# EAGLE design bristol_longshot (EAGLE 7.3.0)
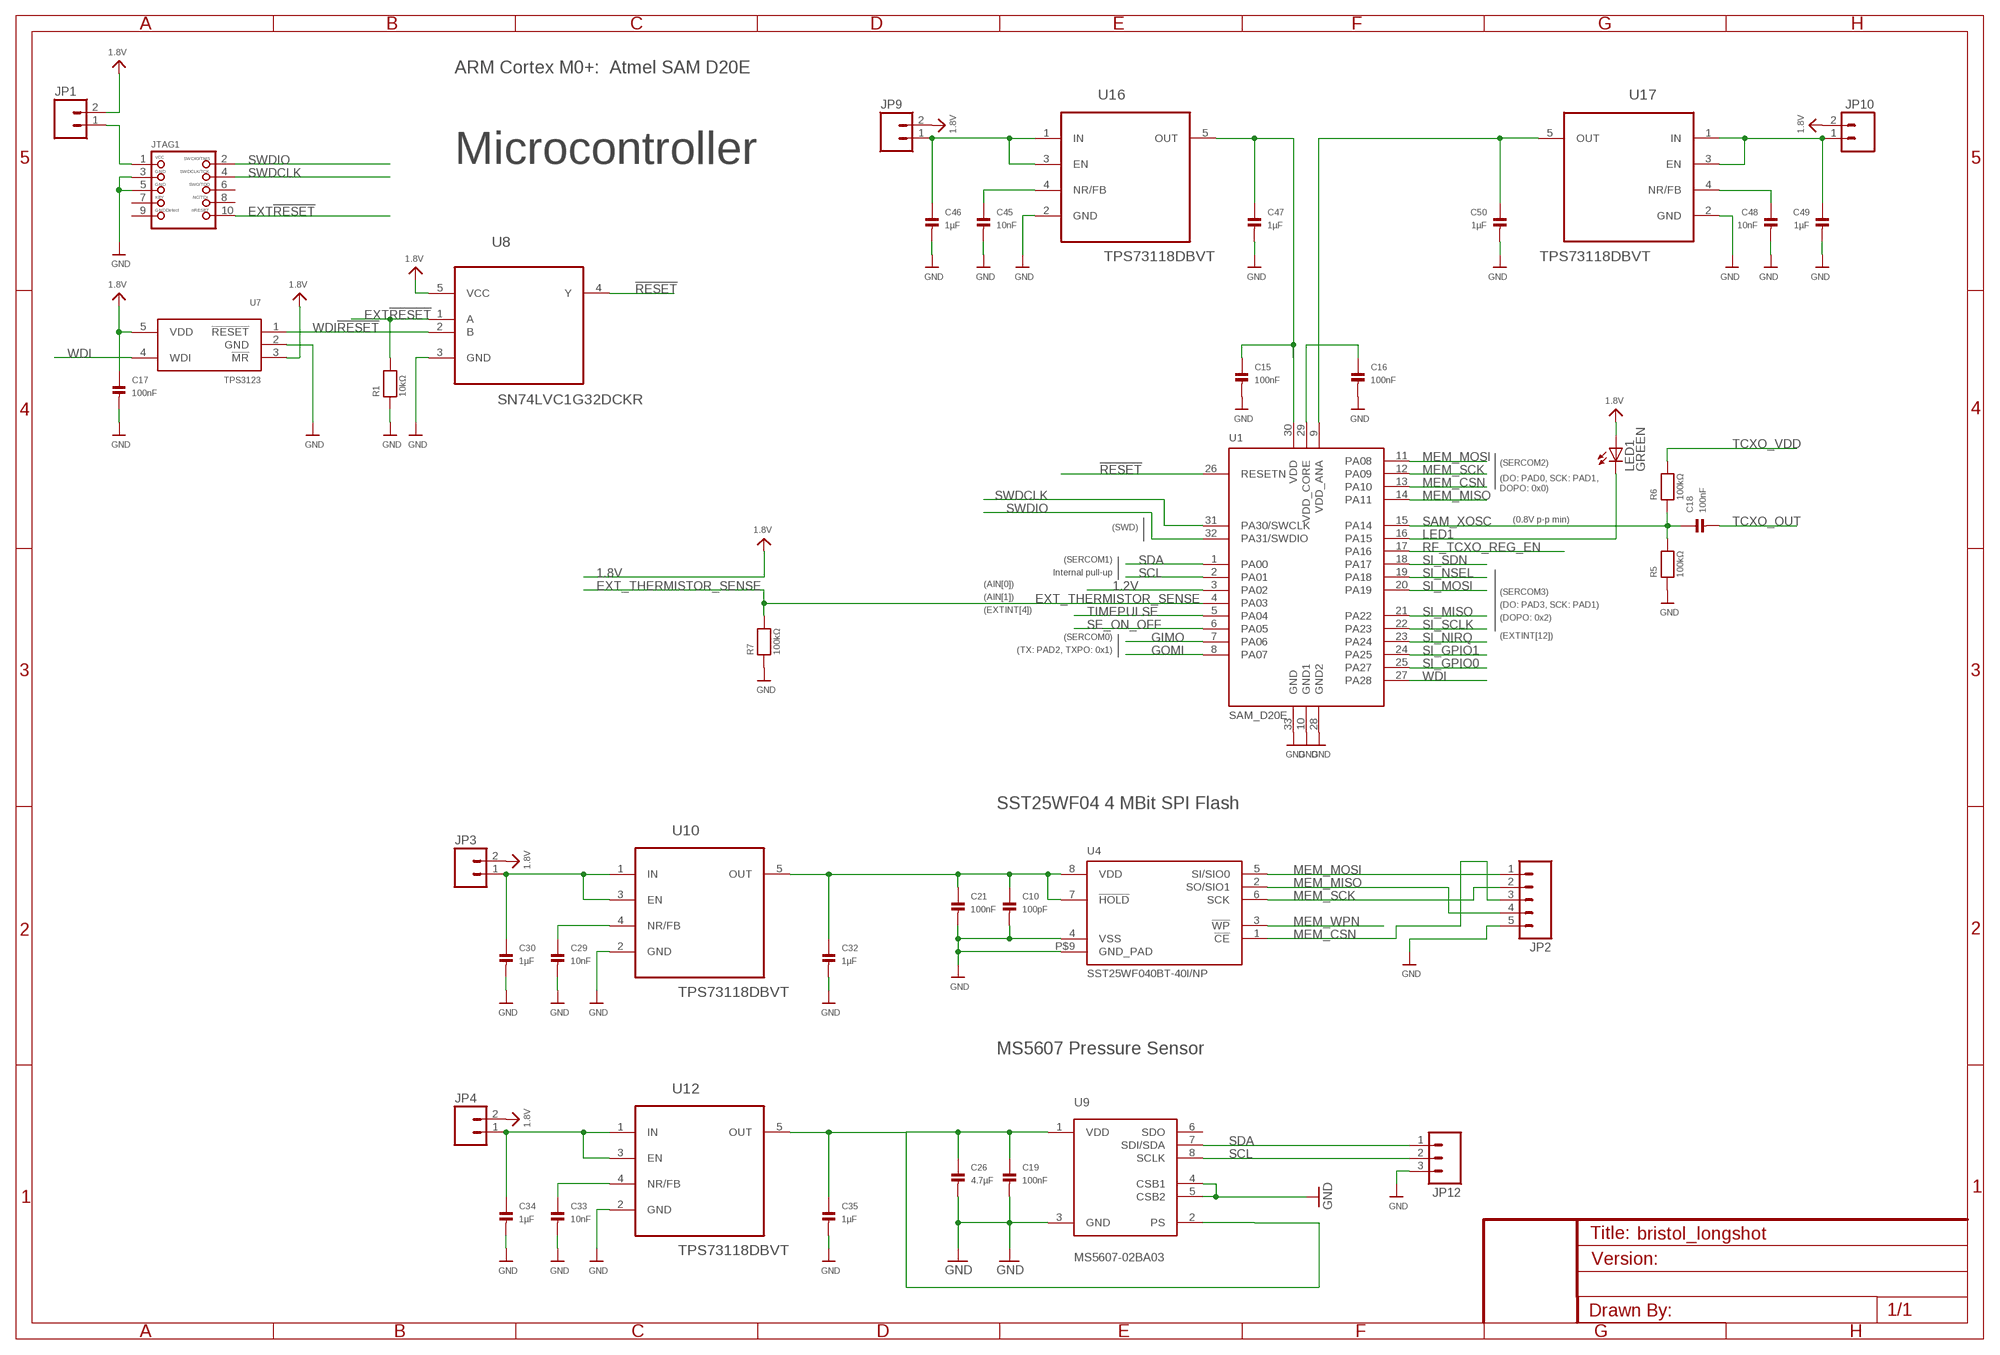
[diagram p0: schematic, sheet 1, part 1 of 2]
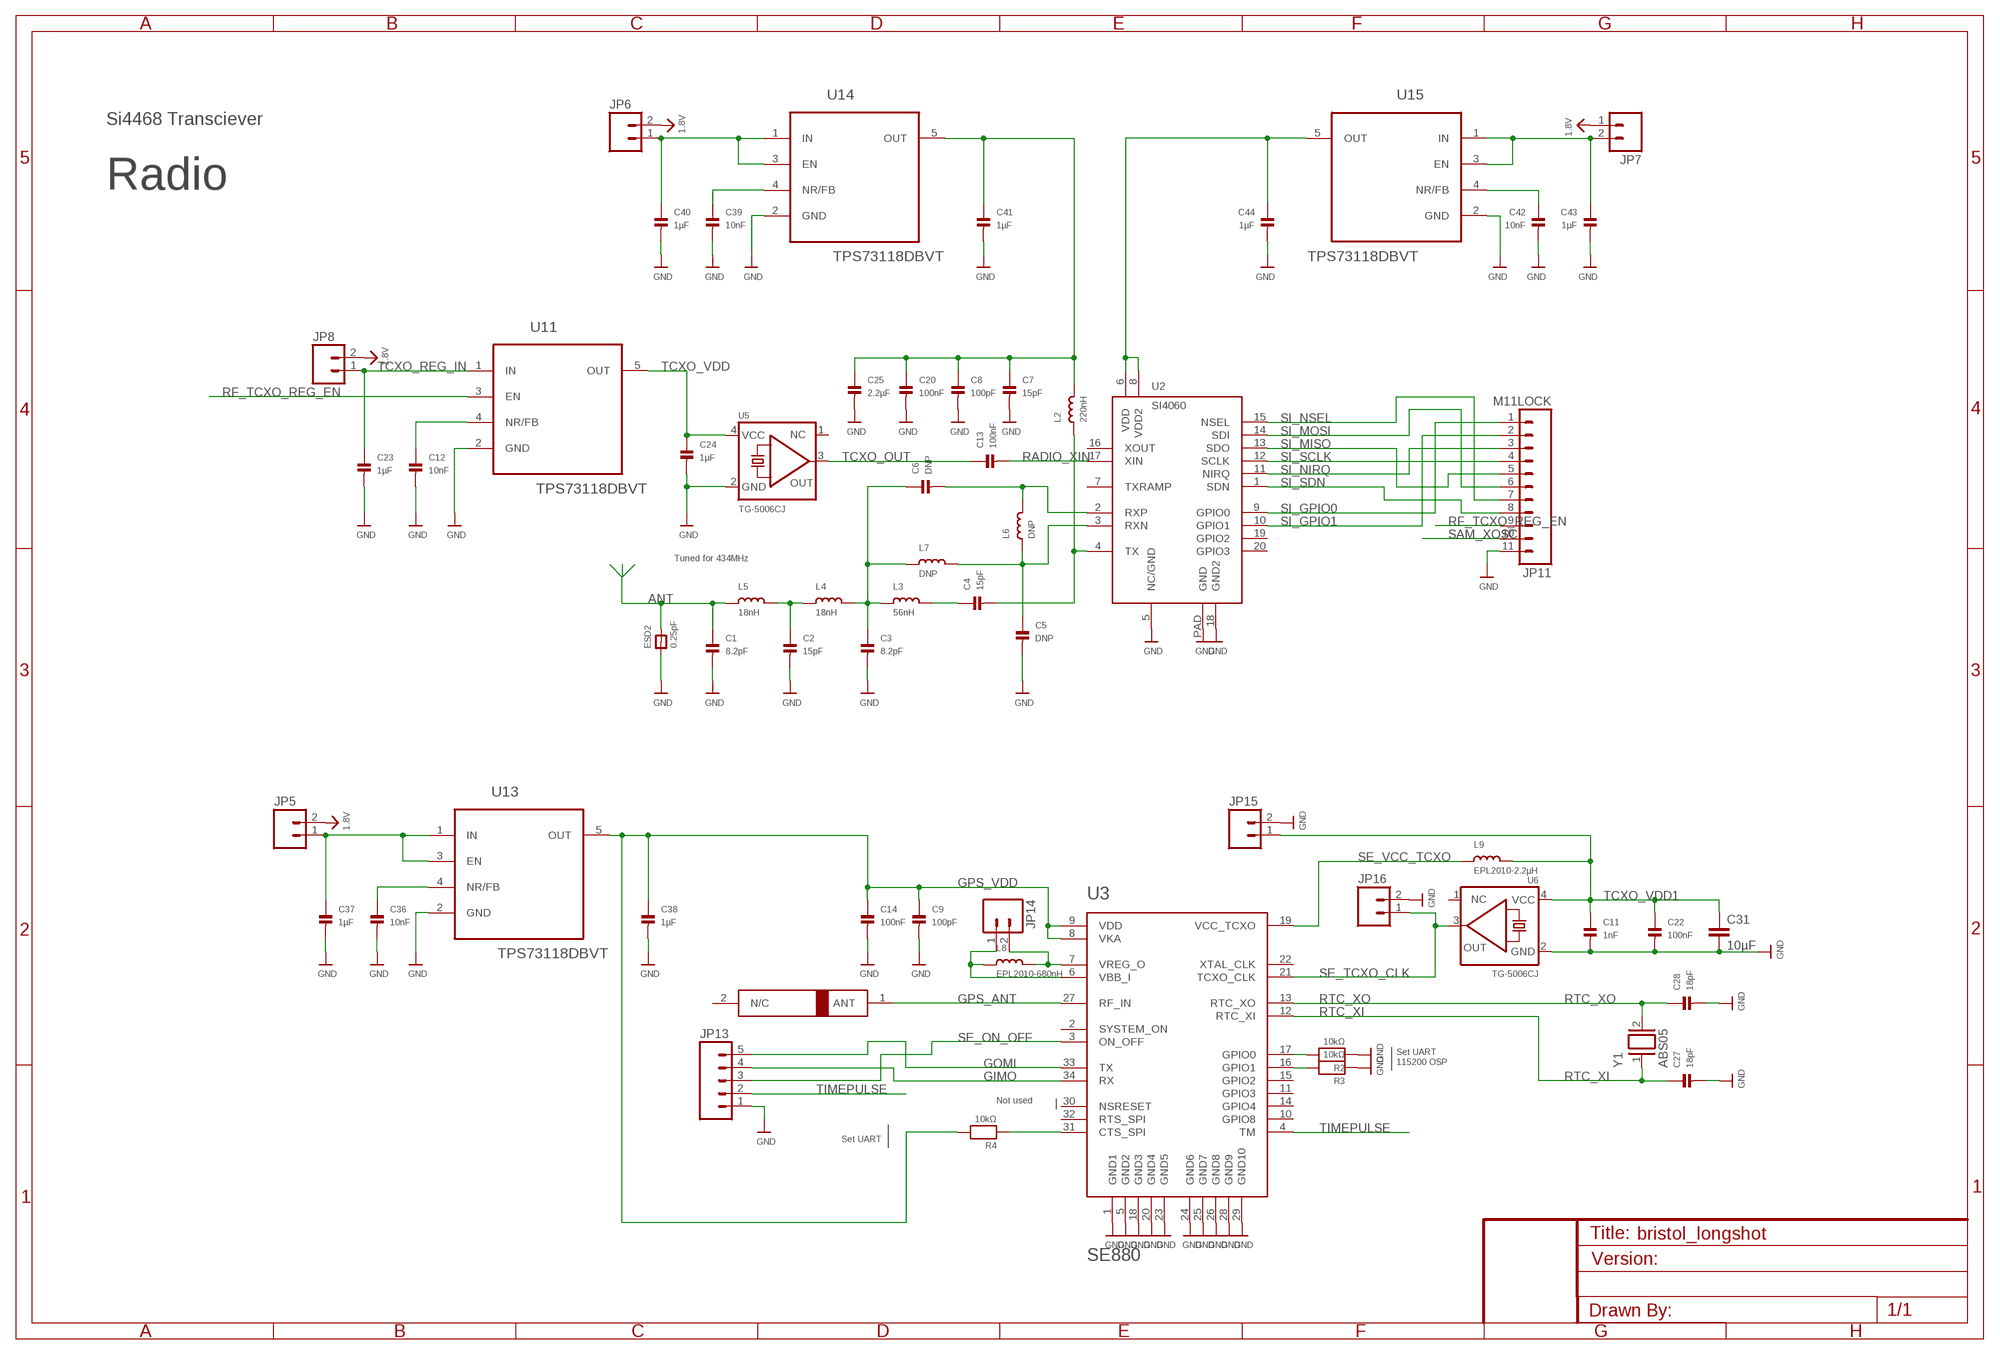
[diagram p1: schematic, sheet 1, part 2 of 2]

## Parts
A1  1575AT43A40  [1575AT43A40]
C1  8.2pF  CAP_CERAMIC_0402  [_0402@2]
C2  15pF  CAP_CERAMIC_0402  [_0402@2]
C3  8.2pF  CAP_CERAMIC_0402  [_0402@2]
C4  15pF  CAP_CERAMIC_0402  [_0402@2]
C5  DNP  CAP_CERAMIC_0402  [_0402@2]
C6  DNP  CAP_CERAMIC_0402  [_0402@2]
C7  15pF  CAP_CERAMIC_0402  [_0402@2]
C8  100pF  CAP_CERAMIC_0402  [_0402@2]
C9  100pF  CAP_CERAMIC_0402  [_0402@2]
C10  100pF  CAP_CERAMIC_0402  [_0402@2]
C11  1nF  CAP_CERAMIC_0402  [_0402@2]
C12  10nF  CAP_CERAMIC_0402  [_0402@2]
C13  100nF  CAP_CERAMIC_0402  [_0402@2]
C14  100nF  CAP_CERAMIC_0402  [_0402@2]
C15  100nF  CAP_CERAMIC_0402  [_0402@2]
C16  100nF  CAP_CERAMIC_0402  [_0402@2]
C17  100nF  CAP_CERAMIC_0402  [_0402@2]
C18  100nF  CAP_CERAMIC_0402  [_0402@2]
C19  100nF  CAP_CERAMIC_0402  [_0402@2]
C20  100nF  CAP_CERAMIC_0402  [_0402@2]
C21  100nF  CAP_CERAMIC_0402  [_0402@2]
C22  100nF  CAP_CERAMIC_0402  [_0402@2]
C23  1µF  CAP_CERAMIC_0402  [_0402@2]
C24  1µF  CAP_CERAMIC_0402  [_0402@2]
C25  2.2µF  CAP_CERAMIC_0402  [_0402@2]
C26  4.7µF  CAP_CERAMIC_0402  [_0402@2]
C27  18pF  CAP_CERAMIC_0402  [_0402@2]
C28  18pF  CAP_CERAMIC_0402  [_0402@2]
C29  10nF  CAP_CERAMIC_0402  [_0402@2]
C30  1µF  CAP_CERAMIC_0402  [_0402@2]
C31  10µF  C-EUC0603K  [C0603K]
C32  1µF  CAP_CERAMIC_0402  [_0402@2]
C33  10nF  CAP_CERAMIC_0402  [_0402@2]
C34  1µF  CAP_CERAMIC_0402  [_0402@2]
C35  1µF  CAP_CERAMIC_0402  [_0402@2]
C36  10nF  CAP_CERAMIC_0402  [_0402@2]
C37  1µF  CAP_CERAMIC_0402  [_0402@2]
C38  1µF  CAP_CERAMIC_0402  [_0402@2]
C39  10nF  CAP_CERAMIC_0402  [_0402@2]
C40  1µF  CAP_CERAMIC_0402  [_0402@2]
C41  1µF  CAP_CERAMIC_0402  [_0402@2]
C42  10nF  CAP_CERAMIC_0402  [_0402@2]
C43  1µF  CAP_CERAMIC_0402  [_0402@2]
C44  1µF  CAP_CERAMIC_0402  [_0402@2]
C45  10nF  CAP_CERAMIC_0402  [_0402@2]
C46  1µF  CAP_CERAMIC_0402  [_0402@2]
C47  1µF  CAP_CERAMIC_0402  [_0402@2]
C48  10nF  CAP_CERAMIC_0402  [_0402@2]
C49  1µF  CAP_CERAMIC_0402  [_0402@2]
C50  1µF  CAP_CERAMIC_0402  [_0402@2]
ESD2  0.25pF  FERRITE_0603MP  [_0603MP]
JP1  M02LOCK  [1X02_LOCK]
JP2  M05LOCK  [1X05_LOCK]
JP3  M02LOCK  [1X02_LOCK]
JP4  M02LOCK  [1X02_LOCK]
JP5  M02LOCK  [1X02_LOCK]
JP6  M02LOCK  [1X02_LOCK]
JP7  M02LOCK  [1X02_LOCK]
JP8  M02LOCK  [1X02_LOCK]
JP9  M02LOCK  [1X02_LOCK]
JP10  M02LOCK  [1X02_LOCK]
JP11  M11LOCK  [1X11_LOCK]
JP12  M03LOCK  [1X03_LOCK]
JP13  M05LOCK  [1X05_LOCK]
JP14  M02LOCK  [1X02_LOCK]
JP15  M02LOCK  [1X02_LOCK]
JP16  M02LOCK  [1X02_LOCK]
JTAG1  JTAG-CORTEXM3SMT  [2X05_1.27MM_SMT]
L2  220nH  INDUCTOR_0402  [_0402@1]
L3  56nH  INDUCTOR_0402  [_0402@1]
L4  18nH  INDUCTOR_0402  [_0402@1]
L5  18nH  INDUCTOR_0402  [_0402@1]
L6  DNP  INDUCTOR_0402  [_0402@1]
L7  DNP  INDUCTOR_0402  [_0402@1]
L8  EPL2010-680nH  EPL2010  [EPL2010]
L9  EPL2010-2.2µH  EPL2010  [EPL2010]
LED1  GREEN  LEDCHIPLED_0603  [CHIPLED_0603]
R1  10kΩ  RESISTOR_0402  [_0402]
R2  10kΩ  RESISTOR_0402  [_0402]
R3  10kΩ  RESISTOR_0402  [_0402]
R4  10kΩ  RESISTOR_0402  [_0402]
R5  100kΩ  RESISTOR_0402  [_0402]
R6  100kΩ  RESISTOR_0402  [_0402]
R7  100kΩ  RESISTOR_0402  [_0402]
U1  SAM_D20E  [QFN32_5MM]
U2  SI4060  [QFN20]
U3  SE880  [SE880]
U4  SST25WF040BT-40I/NP  [USON-8]
U5  TG-5006CJ  [TC-5006CJ]
U6  TG-5006CJ  [TC-5006CJ]
U7  TPS3123  [SOT23-5]
U8  SN74LVC1G32DCKR  [SOT65P210X110-5N]
U9  MS5607-02BA03  [MS5607-02BA03]
U10  TPS73118DBVT  [SOT95P280X145-5N]
U11  TPS73118DBVT  [SOT95P280X145-5N]
U12  TPS73118DBVT  [SOT95P280X145-5N]
U13  TPS73118DBVT  [SOT95P280X145-5N]
U14  TPS73118DBVT  [SOT95P280X145-5N]
U15  TPS73118DBVT  [SOT95P280X145-5N]
U16  TPS73118DBVT  [SOT95P280X145-5N]
U17  TPS73118DBVT  [SOT95P280X145-5N]
Y1  ABS05  [ABS05]

## Nets
1.2V: U1.3(PA02)
1.8V: C17.1 JP1.2 JP3.2 JP4.2 JP5.2 JP6.2 JP7.1 JP8.2 JP9.2 JP10.2 LED1.A U7.3(!MR) U7.5(VDD) U8.5(VCC)
!RESET: U1.26(RESETN) U8.4(Y)
ANT: C1.1 ESD2.2 L5.1
EXT!RESET: JTAG1.10 R1.2 U8.1(A)
EXT_THERMISTOR_SENSE: R7.2 U1.4(PA03)
FILTER1: C3.1 C6.1 L3.1 L4.2 L7.1
FILTER2: C2.1 L4.1 L5.2
GIMO: JP13.4 U1.7(PA06) U3.34(RX)
GND: C1.2 C2.2 C3.2 C5.2 C7.2 C8.2 C9.2 C10.2 C11.2 C12.2 C14.2 C15.2 C16.2 C17.2 C19.2 C20.2 C21.2 C22.2 C23.2 C24.2 C25.2 C26.2 C27.2 C28.2 C29.2 C30.2 C31.2 C32.2 C33.2 C34.2 C35.2 C36.2 C37.2 C38.2 C39.2 C40.2 C41.2 C42.2 C43.2 C44.2 C45.2 C46.2 C47.2 C48.2 C49.2 C50.2 ESD2.1 JP2.5 JP11.11 JP12.3 JP13.1 JP15.2 JP16.2 JTAG1.3 JTAG1.5 R1.1 R2.1 R3.1 R5.1 R7.1 U1.10(GND1) U1.28(GND2) U1.33(GND) U2.5(NC/GND) U2.18(GND2) U2.PAD(GND) U3.1(GND1) U3.5(GND2) U3.18(GND3) U3.20(GND4) U3.23(GND5) U3.24(GND6) U3.25(GND7) U3.26(GND8) U3.28(GND9) U3.29(GND10) U4.4(VSS) U4.P$9(GND_PAD) U5.2(GND) U6.2(GND) U7.2(GND) U8.3(GND) U9.3(GND) U9.4(CSB1) U9.5(CSB2) U10.2(GND) U11.2(GND) U12.2(GND) U13.2(GND) U14.2(GND) U15.2(GND) U16.2(GND) U17.2(GND)
GOMI: JP13.5 U1.8(PA07) U3.33(TX)
GPS_ANT: A1.1(ANT) U3.27(RF_IN)
GPS_VDD: C9.1 C14.1 C38.1 R4.2 U3.8(VKA) U3.9(VDD) U13.5(OUT)
LED1: LED1.C U1.16(PA15)
MEM_CSN: JP2.3 U1.13(PA10) U4.1(!CE)
MEM_MISO: JP2.4 U1.14(PA11) U4.2(SO/SIO1)
MEM_MOSI: JP2.1 U1.11(PA08) U4.5(SI/SIO0)
MEM_SCK: JP2.2 U1.12(PA09) U4.6(SCK)
MEM_WPN: U4.3(!WP)
N$5: JP1.1 JTAG1.1
N$8: C30.1 JP3.1 U10.1(IN) U10.3(EN)
N$9: C29.1 U10.4(NR/FB)
N$12: C10.1 C21.1 C32.1 U4.7(!HOLD) U4.8(VDD) U10.5(OUT)
N$13: C34.1 JP4.1 U12.1(IN) U12.3(EN)
N$14: C33.1 U12.4(NR/FB)
N$15: C19.1 C26.1 C35.1 U9.1(VDD) U9.2(PS) U12.5(OUT)
N$16: C37.1 JP5.1 U13.1(IN) U13.3(EN)
N$17: C36.1 U13.4(NR/FB)
N$18: C46.1 JP9.1 U16.1(IN) U16.3(EN)
N$19: C40.1 JP6.1 U14.1(IN) U14.3(EN)
N$20: C39.1 U14.4(NR/FB)
N$21: C45.1 U16.4(NR/FB)
N$22: C43.1 JP7.2 U15.1(IN) U15.3(EN)
N$23: C42.1 U15.4(NR/FB)
N$24: C44.1 U2.6(VDD) U2.8(VDD2) U15.5(OUT)
N$25: C15.1 C47.1 U1.30(VDD) U16.5(OUT)
N$26: C49.1 JP10.1 U17.1(IN) U17.3(EN)
N$27: C48.1 U17.4(NR/FB)
N$30: C50.1 U1.9(VDD_ANA) U17.5(OUT)
RADIO_VDD: C7.1 C8.1 C20.1 C25.1 C41.1 L2.2 U14.5(OUT)
RADIO_XIN: C13.2 U2.17(XIN)
RF_OUT: C4.2 L2.1 U2.4(TX)
RF_TANK: C4.1 L3.2
RF_TCXO_REG_EN: JP11.9 U1.17(PA16) U11.3(EN)
RTC_XI: C27.1 U3.12(RTC_XI) Y1.1
RTC_XO: C28.1 U3.13(RTC_XO) Y1.2
RXN: C5.1 L6.1 L7.2 U2.3(RXN)
RXP: C6.2 L6.2 U2.2(RXP)
SAM_XOSC: C18.1 JP11.10 R5.2 R6.1 U1.15(PA14)
SCL: JP12.2 U1.2(PA01) U9.8(SCLK)
SDA: JP12.1 U1.1(PA00) U9.7(SDI/SDA)
SE_GPIO0: R2.2 U3.17(GPIO0)
SE_GPIO1: R3.2 U3.16(GPIO1)
SE_MODE_PULL: R4.1 U3.31(CTS_SPI)
SE_ON_OFF: JP13.3 U1.6(PA05) U3.3(ON_OFF)
SE_TCXO_CLK: JP16.1 U3.21(TCXO_CLK) U6.3(OUT)
SE_VBB: JP14.1 L8.1 U3.6(VBB_I)
SE_VCC_TCXO: L9.1 U3.19(VCC_TCXO)
SE_VREG: JP14.2 L8.2 U3.7(VREG_O)
SI_GPIO0: JP11.1 U1.25(PA27) U2.9(GPIO0)
SI_GPIO1: JP11.2 U1.24(PA25) U2.10(GPIO1)
SI_MISO: JP11.5 U1.21(PA22) U2.13(SDO)
SI_MOSI: JP11.6 U1.20(PA19) U2.14(SDI)
SI_NIRQ: JP11.3 U1.23(PA24) U2.11(NIRQ)
SI_NSEL: JP11.7 U1.19(PA18) U2.15(NSEL)
SI_SCLK: JP11.4 U1.22(PA23) U2.12(SCLK)
SI_SDN: JP11.8 U1.18(PA17) U2.1(SDN)
SWDCLK: JTAG1.4 U1.31(PA30/SWCLK)
SWDIO: JTAG1.2 U1.32(PA31/SWDIO)
TCXO_OUT: C13.1 C18.2 U5.3(OUT)
TCXO_REG_IN: C23.1 JP8.1 U11.1(IN)
TCXO_REG_NR: C12.1 U11.4(NR/FB)
TCXO_VDD: C24.1 R6.2 U5.4(VCC) U11.5(OUT)
TCXO_VDD1: C11.1 C22.1 C31.1 JP15.1 L9.2 U6.4(VCC)
TIMEPULSE: JP13.2 U1.5(PA04) U3.4(TM)
VDD_CORE: C16.1 U1.29(VDD_CORE)
WDI: U1.27(PA28) U7.4(WDI)
WDI!RESET: U7.1(!RESET) U8.2(B)
Unconnected: A1.2(N/C) JTAG1.6 JTAG1.7 JTAG1.8 JTAG1.9 U2.7(TXRAMP) U2.16(XOUT) U2.19(GPIO2) U2.20(GPIO3) U3.2(SYSTEM_ON) U3.10(GPIO8) U3.11(GPIO3) U3.14(GPIO4) U3.15(GPIO2) U3.22(XTAL_CLK) U3.30(NSRESET) U3.32(RTS_SPI) U5.1(NC) U6.1(NC) U9.6(SDO)

## Notes on the sheet
- ARM Cortex M0+:  Atmel SAM D20E
- Si4468 Transciever
- Microcontroller
- Radio
- (SERCOM2)
- (DO: PAD0, SCK: PAD1,
  DOPO: 0x0)
- (0.8V p-p min)
- (SWD)
- (SERCOM1) | Tuned for 434MHz
- Internal pull-up
- (AIN[0])
- (SERCOM3)
- (AIN[1])
- (DO: PAD3, SCK: PAD1)
- (EXTINT[4])
- (DOPO: 0x2)
- (SERCOM0) | (EXTINT[12])
- (TX: PAD2, TXPO: 0x1)
- SST25WF04 4 MBit SPI Flash
- MS5607 Pressure Sensor
- Set UART
  115200 OSP
- Not used
- Set UART

## Library data of the parts
A1 = 1575AT43A40:1575AT43A40
C1-C30 C32-C50 = microbuilder_v3:CAP_CERAMIC: Ceramic Capacitors 0402 - 0402 Surface Mount Capacitors 16pF 50V 5% [Digikey: 445-4899-2-ND] 18pF 50V 5% [Digikey: 490-1281-2-ND] 22pF 50V 5% [Digikey: 490-1283-2-ND] 68pF 50V 5% [Digikey: 490-1289-2-ND] 0.1uF 10V 10% [Digikey: 490-1318-2-ND] 1.0uF 6.3V 10% [Digikey: 490-1320-2-ND] 0603 - 0603 Surface Mount Capacitors 16 pF 50V 5% [Digikey: 445-5051-2-ND] 22 pF 50V [Digikey: PCC220ACVTR-ND] 33 pF 50V 5% [Digikey: 490-1415-1-ND] 56pF 50V 5% [Digikey: 490-1421-1-ND] 220pF 50V 5% [Digikey: 445-1285-1-ND] 680 pF 50V 2200 pF 50V 5% C0G [Digikey: 445-1297-1-ND] 5600 pF 100V 5% X7R [Digikey: 478-3711-1-ND] 0.1 µF 25V 10% [Digikey: PCC2277TR-ND] 0.22 µF 16V 10% X7R [Digikey: 445-1318-1-ND] 1.0 µF 25V 10% [Digikey: 445-5146-2-ND] 0603 - RF Specific 3pF 250V +/-0.1pF RF [Digikey: 712-1347-1-ND] 18 pF 250V 5% [Digikey: 478-3505-1-ND or 712-1322-1-ND] 56 pF 250V 5% C0G RF [Digikey: 490-4867-1-ND] 68 pF 250V RF [Digikey: 490-4868-1-ND] 0805 - 0805 Surface Mount Capacitors 220 pF 250V 2% RF Ceramic Capacitor [Digikey: 712-1398-1-ND] 1000 pF 50V 2% NP0 Ceramic Capacitor [Digikey: 478-3760-1-ND] 0.1 µF 25V 10% Ceramic Capacitor [Digikey: PCC1828TR-ND] 1.0 µF 16V 10% Ceramic Capacitor[Digikey: 490-1691-2-ND] 10.0 µF 10V 10% Ceramic Capacitor[Digikey: 709-1228-1-ND] 10.0 uF 16V 10% Ceramic Capacitor [Digikey: 478-5165-2-ND] 47 uF 6.3V 20% Ceramic Capacitor [Digikey: 587-1779-1-ND or 399-5506-1-ND] 1206 - 1206 Surface Mount Capacitors 47uF 10V 20% Ceramic Capacitor [Digikey: 490-5528-1-ND or 399-5508-1-ND or 445-6010-1-ND] 100uF 6.3V -20%, +80% Y5V Ceramic Capacitor (Digikey: 490-4512-1-ND, Mouser: 81-GRM31CF50J107ZE1L)
C31 = resistor:C-EU: CAPACITOR, European symbol
ESD2 = microbuilder_v3:FERRITE: Ferrite Bead 0603 MMZ1608B121C - 120 Ohm @ 100MHz, 600mA, 0.15 Ohm DC Resistance - Digikey: 445-2164-1-ND BK1608HW121-T - 120 Ohm, 600mA Ferrite Chip - Digikey: 587-1876-2-ND 0805 HZ0805B272R-10 - 2.7K Ohm @ 100MHz, 200mA, 0.8 Ohm DC Resistance - Digikey: 240-2504-1-ND (see also Murata BLM21BD272SN1L) MMZ2012Y152B - 1.5K Ohm @ 100MHz, 500mA, 0.4 Ohm DC Resistance - Digikey: 445-1560-1-ND - Mainly for high frequency (80-400MHz) MMZ2012R102A - 1K Ohm @ 100MHz, 500mA, 0.3 Ohm DC Resistance - Digikey: 445-1555-2-ND - More general purpose (10-200MHz)
JP1 JP3-JP10 JP14-JP16 = SparkFun:M02: Header 2 Standard 2-pin 0.1" header. Use with straight break away headers (SKU : PRT-00116), right angle break away headers (PRT-00553), swiss pins (PRT-00743), machine pins (PRT-00117), and female headers (PRT-00115). Molex polarized connector foot print use with SKU : PRT-08233 with associated crimp pins and housings.
JP2 JP13 = SparkFun:M05: Header 5 Standard 5-pin 0.1" header. Use with straight break away headers (SKU : PRT-00116), right angle break away headers (PRT-00553), swiss pins (PRT-00743), machine pins (PRT-00117), and female headers (PRT-00115). Molex polarized connector foot print use with SKU : PRT-08230 with associated crimp pins and housings.
JP11 = SparkFun:M11: Header 11 Standard 11-pin 0.1" header. Use with straight break away headers (SKU : PRT-00116), right angle break away headers (PRT-00553), swiss pins (PRT-00743), machine pins (PRT-00117), and female headers (PRT-00115).
JP12 = SparkFun:M03: Header 3 Standard 3-pin 0.1" header. Use with straight break away headers (SKU : PRT-00116), right angle break away headers (PRT-00553), swiss pins (PRT-00743), machine pins (PRT-00117), and female headers (PRT-00115). Molex polarized connector foot print use with SKU : PRT-08232 with associated crimp pins and housings.
JTAG1 = microbuilder_v3:JTAG-CORTEXM3: Serial Wire (SW-DP) Connector This standard 0.05" 10-pin connector is for use with the Cortex M0/M3's native SWD (serial wire debugger) interface (SW-DP). Some boards support a 20-pin combined JTAG+SWD connector (SWJ-DP), such as the LPC1700 family, but many smaller devices only work with SWD which typically use the smaller 10-pin SW-DP connecter (the LPC1300 family, for example, only supports SWD). 2x05 1.27mm/0.05" Connector: This is the standard SMT connector defined by ARM for all Cortex devices, and should be used in most situations and for forward-compatibility since any new devices coming to market will likely use this connector. MOLEX 10 Pin 0.1" Connector: This 0.1" 10 pin connector has the same pin layout as the standard 0.05" connector, but is easier to work with if you are using standard jumper wires or custom cables to connect your SWD hardware. MOLEX 20 Pin 0.1" Connector: This 0.1" 20 pin connector is the same model used for ARM7/ARM9 JTAG debuggers, but is connected to match the pins on the Segger J-Link for ARM (which supports both JTAG and SWD debugging). See the following document from ARM for more information on Cortex M3 Debug Connectors: http://infocenter.arm.com/help/topic/com.arm.doc.faqs/attached/13634/cortex_debug_connectors.pdf And the following page for an overview with images of the different connector types: http://www.keil.com/peripherals/coresight/connectors.asp
L2-L7 = microbuilder_v3:INDUCTOR: Inductors 0603: 10nH Ceramic Inductor - microwire antenna/RF (Digikey: 712-1434-2-ND) 0805: 560nH Ceramic Inductor - RF (Digikey: 553-1047-1-ND) 270nH Ceramic Inductor - Q = 40@250MHz, +-5%, 1 Ohm DC Resistance (Digikey: 535-10506-2-ND) 1007 (2518 Metric) SMT: 10µH 10% 250mOhm 820mA 1007 Inductor (Digikey: 587-2189-1-ND) 22µH 10% 500mOhm 580mA 1007 Inductor (Digikey: 587-2190-1-ND) 47µH 10% 950mOhm 420mA 1007 Inductor (Digikey: 587-2191-1-ND) 47µH 5% 100mOhm 1A 1008 Inductor (Digikey: 732-1816-1-ND) 5.0x5.0mm (Taiyo Yuden NR5040 Series) 6.8µH 20% 2.3A 64mOhm Inductor (Digikey: 587-2374-2-ND) 5.0x5.0mm (TDK VLC5045 Series) 4.7µH 20% 3.3A 34mOhm Inductor (Digikey: 445-6526-1-ND) 6.8µH 20% 2.7A 46mOhm Inductor (Digikey: 445-6527-1-ND) 6.0x6.0mm (TDK VLC6045 Series) 4.7µH 20% 3.8A 27mOhm Inductor (Digikey: 445-6538-2-ND) 6.8µH 20% 3A 41mOhm Inductor (Digikey: 445-6540-1-ND) 6.2µH 30% 2.2A 45mOhm Inductor (Digikey: SRR5028-6R2YCT-ND) - Not TDK VLC6045 but footprint should match 6.0x6.0mm (TDK SLF6045 Series) 6.8uH 30% 2A 33mOhm Inductor (Digikey: 445-4572-1-ND, Mouser: 810-SLF645T6R8N2R0PF)
L8 L9 = Coilcraft_XAL:EPL2010
LED1 = led:LED: LED OSRAM: - CHIPLED LG R971, LG N971, LY N971, LG Q971, LY Q971, LO R971, LY R971 LH N974, LH R974 LS Q976, LO Q976, LY Q976 LO Q996 - Hyper CHIPLED LW Q18S LB Q993, LB Q99A, LB R99A - SideLED LS A670, LO A670, LY A670, LG A670, LP A670 LB A673, LV A673, LT A673, LW A673 LH A674 LY A675 LS A676, LA A676, LO A676, LY A676, LW A676 LS A679, LY A679, LG A679 - Hyper Micro SIDELED® LS Y876, LA Y876, LO Y876, LY Y876 LT Y87S - SmartLED LW L88C, LW L88S LB L89C, LB L89S, LG L890 LS L89K, LO L89K, LY L89K LS L896, LA L896, LO L896, LY L896 - TOPLED LS T670, LO T670, LY T670, LG T670, LP T670 LSG T670, LSP T670, LSY T670, LOP T670, LYG T670 LG T671, LOG T671, LSG T671 LB T673, LV T673, LT T673, LW T673 LH T674 LS T676, LA T676, LO T676, LY T676, LB T676, LH T676, LSB T676, LW T676 LB T67C, LV T67C, LT T67C, LS T67K, LO T67K, LY T67K, LW E67C LS E67B, LA E67B, LO E67B, LY E67B, LB E67C, LV E67C, LT E67C LW T67C LS T679, LY T679, LG T679 LS T770, LO T770, LY T770, LG T770, LP T770 LB T773, LV T773, LT T773, LW T773 LH T774 LS E675, LA E675, LY E675, LS T675 LS T776, LA T776, LO T776, LY T776, LB T776 LHGB T686 LT T68C, LB T68C - Hyper Mini TOPLED® LB M676 - Mini TOPLED Santana® LG M470 LS M47K, LO M47K, LY M47K Source: http://www.osram.convergy.de LUXEON: - LUMILED® LXK2-PW12-R00, LXK2-PW12-S00, LXK2-PW14-U00, LXK2-PW14-V00 LXK2-PM12-R00, LXK2-PM12-S00, LXK2-PM14-U00 LXK2-PE12-Q00, LXK2-PE12-R00, LXK2-PE12-S00, LXK2-PE14-T00, LXK2-PE14-U00 LXK2-PB12-K00, LXK2-PB12-L00, LXK2-PB12-M00, LXK2-PB14-N00, LXK2-PB14-P00, LXK2-PB14-Q00 LXK2-PR12-L00, LXK2-PR12-M00, LXK2-PR14-Q00, LXK2-PR14-R00 LXK2-PD12-Q00, LXK2-PD12-R00, LXK2-PD12-S00 LXK2-PH12-R00, LXK2-PH12-S00 LXK2-PL12-P00, LXK2-PL12-Q00, LXK2-PL12-R00 Source: www.luxeon.com KINGBRIGHT: KA-3528ASYC Source: www.kingbright.com
R1-R7 = microbuilder_v3:RESISTOR: Resistors 0402 - 0402 Surface Mount Package 22 Ohm 1% 1/16W [Digikey: 311-22.0LRTR-ND] 33 Ohm 5% 1/16W 1.0K 5% 1/16W 1.5K 5% 1/16W 2.0K 1% 1/16W 10.0K 1% 1/16W [Digikey: 311-10.0KLRTR-ND] 10.0K 5% 1/16W [Digikey: RMCF0402JT10K0TR-ND] 12.1K 1% 1/16W [Digikey: 311-22.0LRTR-ND] 100.0K 5% 1/16W 0603 - 0603 Surface Mount Package 0 Ohm 1/10 Watt 1% Resistor 15 Ohm 1/10 Watt 1% Resistor 33 Ohm 1/10 Watt 1% Resistor 49.9 Ohm 1/10 Watt 1% Resistor 100 Ohm 1/10 Watt 1% Resistor 150 Ohm 1/10 Watt 1% Resistor 240 Ohm 1/10 Watt 1% Resistor 390 Ohm 1/10 Watt 1% Resistor 560 Ohm 1/10 Watt 1% Resistor 680 Ohm 1/10 Watt 1% Resistor 750 Ohm 1/10 Watt 1% Resistor 1.0K Ohm 1/10 Watt 1% Resistor 1.5K Ohm 1/10 Watt 1% Resistor 2.0K Ohm 1/10 Watt 1% Resistor 2.2K Ohm 1/10 Watt 1% Resistor 3.3K Ohm 1/10 Watt 1% Resistor 4.7K Ohm 1/10 Watt 1% Resistor 10.0K Ohm 1/10 Watt 1% Resistor 12.0K Ohm 1/10 Watt 1% Resistor 12.1K Ohm 1/10 Watt 1% Resistor 20.0K Ohm 1/10 Watt 1% Resistor 33.0K Ohm 1/10 Watt 1% Resistor 100.0K Ohm 1/10 Watt 1% Resistor 0805 - 0805 Surface Mount Package 0 Ohm 1/8 Watt 1% Resistor 33 Ohm 1/8 Watt 1% Resistor 100 Ohm 1/8 Watt 1% Resistor 150 Ohm 1/8 Watt 1% Resistor 200 Ohm 1/8 Watt 1% Resistor 240 Ohm 1/8 Watt 1% Resistor 330 Ohm 1/8 Watt 1% Resistor 390 Ohm 1/8 Watt 1% Resistor 470 Ohm 1/8 Watt 1% Resistor 1.0K Ohm 1/8 Watt 1% Resistor 1.5K Ohm 1/8 Watt 1% Resistor 2.0K Ohm 1/8 Watt 1% Resistor 4.7K Ohm 1/8 Watt 1% Resistor 5.1K Ohm 1/8 Watt 1% Resistor 5.6K Ohm 1/8 Watt 1% Resistor 10.0K Ohm 1/8 Watt 1% Resistor 22.0K Ohm 1/8 Watt 1% Resistor 33.0K Ohm 1/8 Watt 1% Resistor 100K Ohm 1/8 Watt 1% Resistor 1206 - 1206 Surface Mount Package 2012 - 2010 Surface Mount Package 0.11 Ohm 1/2 Watt 1% Resistor - Digikey: RHM.11UCT-ND
U1 = fbri:SAM_D20E
U2 = fbri:SI4060
U3 = fbri:SE880
U4 = fbri:SST25WF040BT-40I/NP
U5 U6 = fbri:TG-5006CJ
U7 = TPS3125:TPS3123
U8 = SN74LVC1G32DCKR:SN74LVC1G32DCKR: 2-INPUT POSITIVE-OR GATE; MPN: SN74LVC1G32DCKR; OC_FARNELL: 1470880; OC_NEWARK: 76C4094; PACKAGE: SC-70-5; SUPPLIER: Texas Instruments
U9 = MS5607-02BA03:MS5607-02BA03
U10-U17 = TPS73118DVBT:TPS73118DBVT: Cap-Free, NMOS, 150mA Low Dropout Regulator with Reverse Current Protection; MPN: TPS73118DBVT; OC_FARNELL: 1135388; OC_NEWARK: 87H2948; PACKAGE: SOT-23-5; SUPPLIER: Texas Instruments
Y1 = fbri:ABS05

## Board
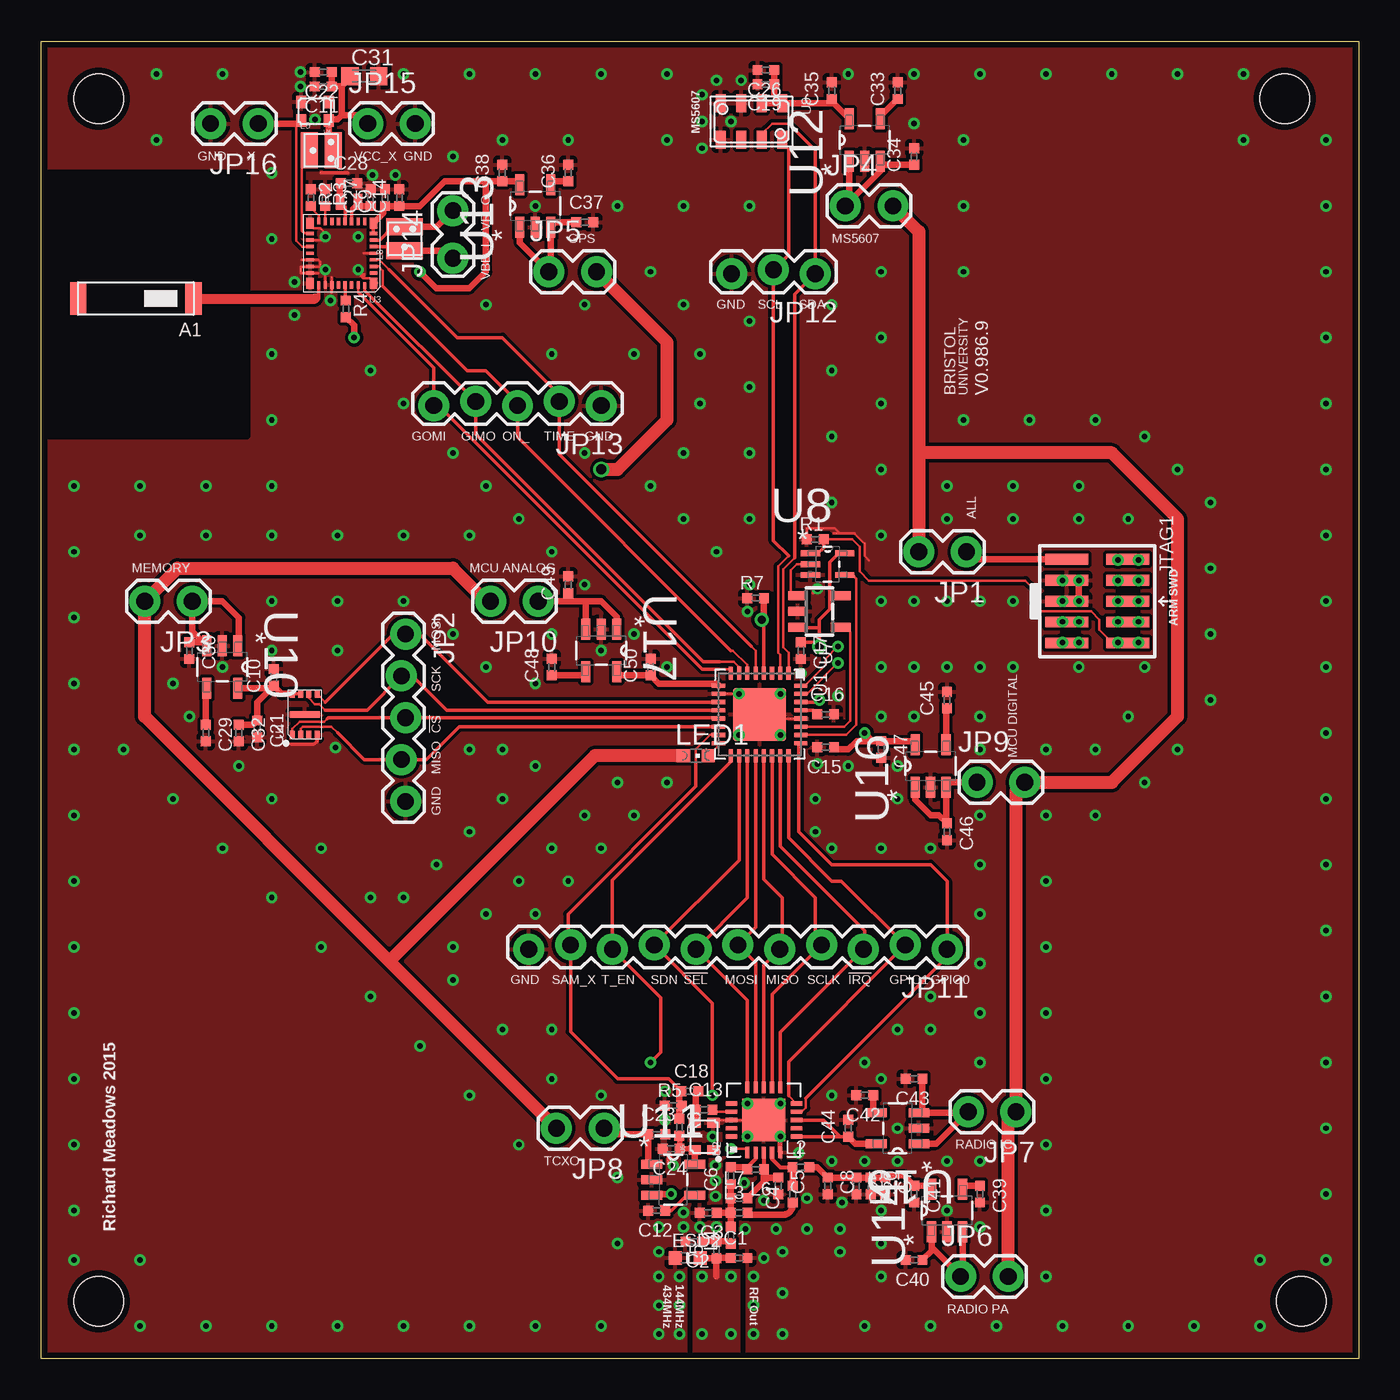
[diagram p2: board, top side]
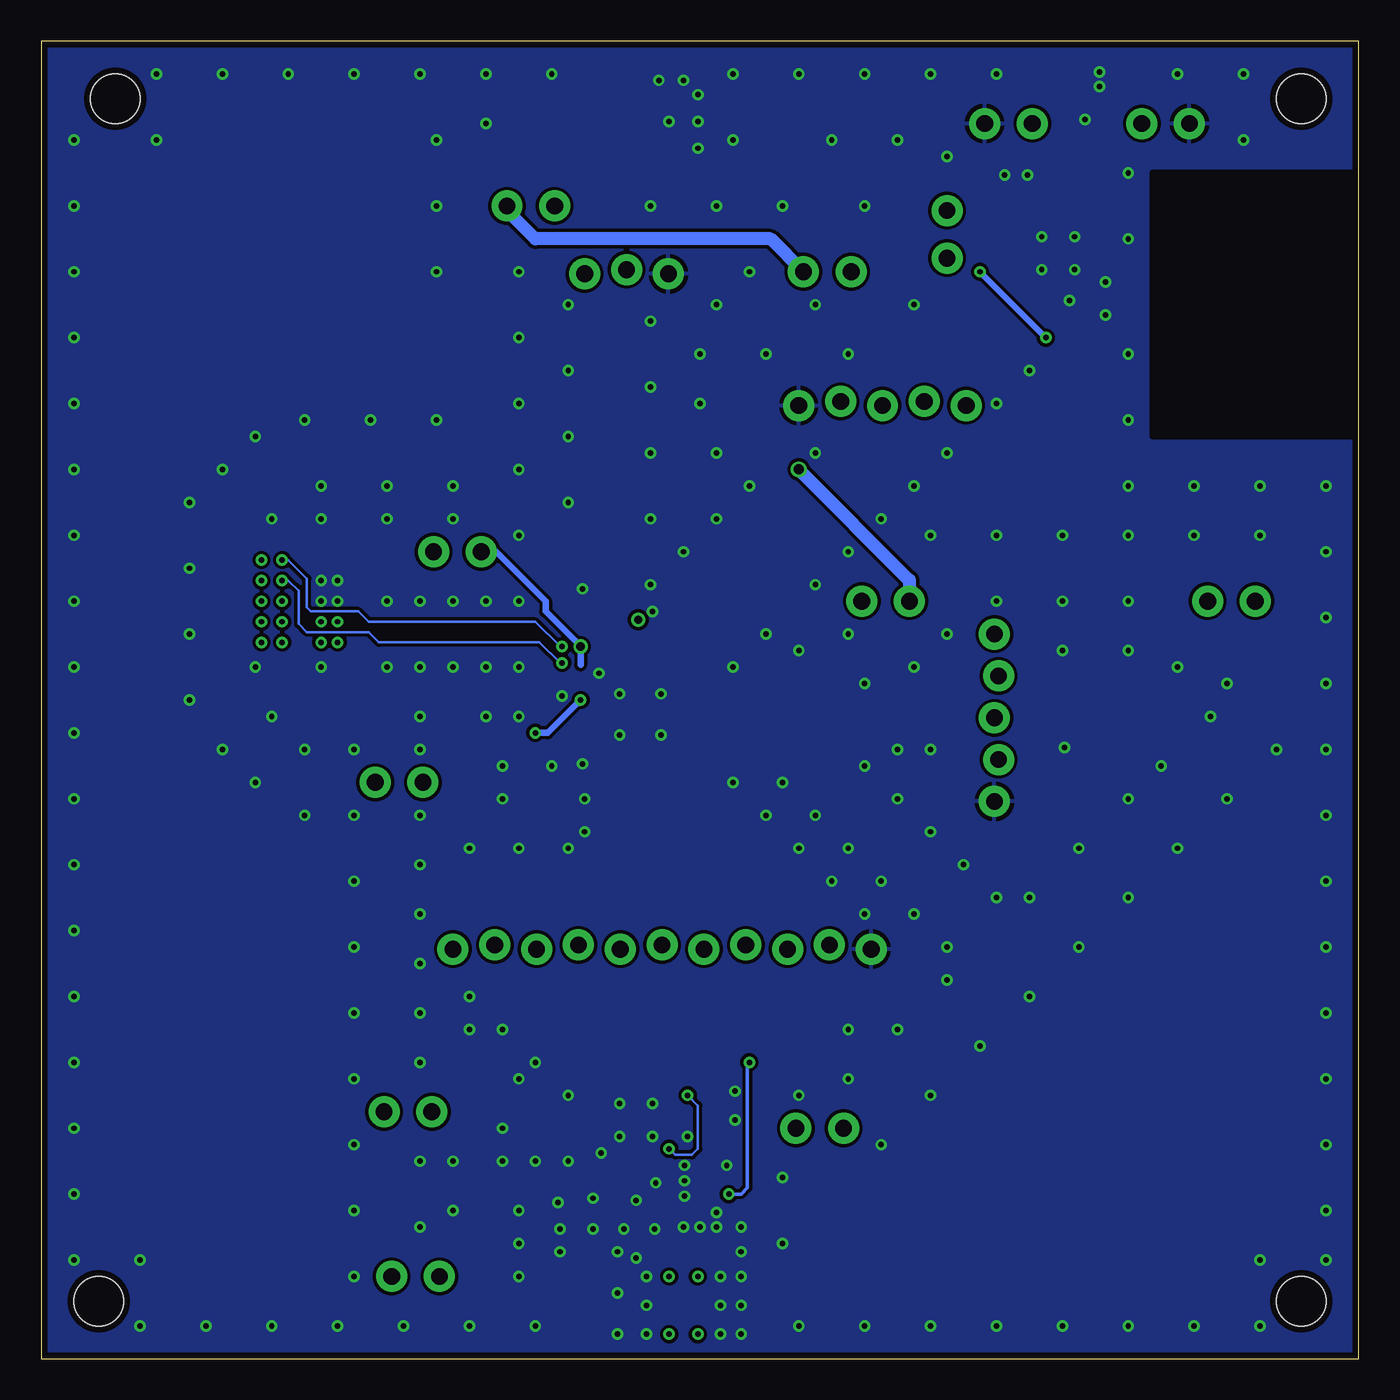
[diagram p3: board, bottom side, seen from below]

Size 80 x 80 mm. Coordinates in mm from the lower left corner, seen from the top.
Outline: 0,0 0,80 80,80 80,0 0,0
Copper layers (1*16): Top 0.0356mm / dielectric 1.5011mm / Bottom 0.0356mm
Design rules "oshpark *": minimum track width 6mil, minimum drill 13mil, track to track 6mil, track to pad 6mil, pad to pad 6mil, via to via 6mil, smd to smd 6mil, copper to edge 15mil, drill to drill 6mil, minimum pad ring 7mil, minimum via ring 7mil, stop-mask expansion 3mil, vias tented up to drill 13mil, thermal gap 10mil
Holes 3 mm at 3.5,3.5 76.5,3.5 3.5,76.5 75.5,76.5
tRestrict: area 0.5,56 to 12.5,72
bRestrict: area 0.5,56 to 12.5,72

### Footprints (pad centres in the part's own frame; a part is rotated, then mirrored left to right if it is on the bottom)
1575AT43A40 = smd 1 x 2: 1 -3.5,0; 2 3.5,0
_0402@2 = smd 0.6 x 0.6: 1 -0.508,0; 2 0.508,0
C0603K = smd 1.05 x 1.08: 1 -0.875,0; 2 0.875,0
_0603MP = smd 0.8 x 0.8: 1 -0.762,0; 2 0.762,0
1X02_LOCK = drill 1.016 pad 1.88: 1 -0.178,0; 2 2.718,0
1X05_LOCK = drill 1.016 pad 1.88: 1 0,0.127; 2 2.54,-0.127; 3 5.08,0.127; 4 7.62,-0.127; 5 10.16,0.127
1X11_LOCK = drill 1.016 pad 1.88: 1 0,0.127; 2 2.54,-0.127; 3 5.08,0.127; 4 7.62,-0.127; 5 10.16,0.127; 6 12.7,-0.127; 7 15.24,0.127; 8 17.78,-0.127; 9 20.32,0.127; 10 22.86,-0.127; 11 25.4,0.127
1X03_LOCK = drill 1.016 pad 1.88: 1 0,0.127; 2 2.54,-0.127; 3 5.08,0.127
2X05_1.27MM_SMT = smd 0.65 x 2.6: 1 -2.54,-1.85; 2 -2.54,1.85; 3 -1.27,-1.85; 4 -1.27,1.85; 5 0,-1.85; 6 0,1.85; 7 1.27,-1.85; 8 1.27,1.85; 9 2.54,-1.85; 10 2.54,1.85
_0402@1 = smd 0.6 x 0.6: 1 -0.508,0; 2 0.508,0
EPL2010 = smd 1.04 x 2.2: 1 -0.725,0; 2 0.725,0
CHIPLED_0603 = smd 0.8 x 0.8: A 0,-0.75; C 0,0.75
_0402 = smd 0.6 x 0.6: 1 -0.508,0; 2 0.508,0
QFN32_5MM = smd 0.8 x 0.25: 1 -2.5,1.75; 2 -2.5,1.25; 3 -2.5,0.75; 4 -2.5,0.25; 5 -2.5,-0.25; 6 -2.5,-0.75; 7 -2.5,-1.25; 8 -2.5,-1.75; 17 2.5,-1.75; 18 2.5,-1.25; 19 2.5,-0.75; 20 2.5,-0.25; 21 2.5,0.25; 22 2.5,0.75; 23 2.5,1.25; 24 2.5,1.75 | smd 0.25 x 0.8: 9 -1.75,-2.5; 10 -1.25,-2.5; 11 -0.75,-2.5; 12 -0.25,-2.5; 13 0.25,-2.5; 14 0.75,-2.5; 15 1.25,-2.5; 16 1.75,-2.5; 25 1.75,2.5; 26 1.25,2.5; 27 0.75,2.5; 28 0.25,2.5; 29 -0.25,2.5; 30 -0.75,2.5; 31 -1.25,2.5; 32 -1.75,2.5 | smd 3.2 x 3.2: 33 0,0
QFN20 = smd 0.7 x 0.25: 1 -1.97,1; 2 -1.97,0.5; 3 -1.97,0; 4 -1.97,-0.5; 5 -1.97,-1; 11 1.97,-1; 12 1.97,-0.5; 13 1.97,0; 14 1.97,0.5; 15 1.97,1 | smd 0.25 x 0.7: 6 -1,-1.97; 7 -0.5,-1.97; 8 0,-1.97; 9 0.5,-1.97; 10 1,-1.97; 16 1,1.97; 17 0.5,1.97; 18 0,1.97; 19 -0.5,1.97; 20 -1,1.97 | smd 2.6 x 2.6: PAD 0,0
SE880 = smd 0.45 x 0.65: 1 -1.925,1.825; 9 -1.925,-1.825; 18 1.925,-1.825; 26 1.925,1.825 | smd 0.45 x 0.2: 2 -1.925,1.2; 3 -1.925,0.8; 4 -1.925,0.4; 5 -1.925,0; 6 -1.925,-0.4; 7 -1.925,-0.8; 8 -1.925,-1.2; 19 1.925,-1.2; 20 1.925,-0.8; 21 1.925,-0.4; 22 1.925,0; 23 1.925,0.4; 24 1.925,0.8; 25 1.925,1.2 | smd 0.2 x 0.45: 10 -1.4,-1.925; 11 -1,-1.925; 12 -0.6,-1.925; 13 -0.2,-1.925; 14 0.2,-1.925; 15 0.6,-1.925; 16 1,-1.925; 27 1.4,1.925; 28 1,1.925; 29 0.6,1.925; 30 0.2,1.925; 31 -0.2,1.925; 32 -0.6,1.925; 33 -1,1.925 | smd 0.2 x 0.39: 17 1.4,-1.955; 34 -1.4,1.955
USON-8 = smd 0.3 x 0.5: 1 -0.75,-1.25; 2 -0.25,-1.25; 3 0.25,-1.25; 4 0.75,-1.25; 5 0.75,1.25; 6 0.25,1.25; 7 -0.25,1.25; 8 -0.75,1.25 | smd 1.8 x 0.4: P$9 0,0
TC-5006CJ = smd 0.6 x 0.75: 1 -0.825,-0.565; 2 0.825,-0.565; 3 0.825,0.565; 4 -0.825,0.565
SOT23-5 = smd 0.55 x 1.2: 1 -0.95,-1.3; 2 0,-1.3; 3 0.95,-1.3; 4 0.95,1.3; 5 -0.95,1.3
SOT65P210X110-5N = smd 1.168 x 0.356: 1 -1.041,0.66; 2 -1.041,0; 3 -1.041,-0.66; 4 1.041,-0.66; 5 1.041,0.66
MS5607-02BA03 = smd 1.1 x 0.6: 1 -1.1,1.875; 2 -1.1,0.625; 3 -1.1,-0.625; 4 -1.1,-1.875; 5 1.1,-1.875; 6 1.1,-0.625; 7 1.1,0.625; 8 1.1,1.875
SOT95P280X145-5N = smd 1.27 x 0.559: 1 -1.295,0.94; 2 -1.295,0; 3 -1.295,-0.94; 4 1.295,-0.94; 5 1.295,0.94
ABS05 = smd 0.5 x 1: 1 0.55,0; 2 -0.55,0

### Placement (x,y rotation side)
A1  5.75,64.38 180 top
C1  42.38,6.12 0 top
C2  39.62,7.12 180 top
C3  40.5,8.88 180 top
C4  45.62,10 90 top
C5  44.75,10.5 270 top
C6  41.88,11.12 90 top
C7  51.25,10.5 270 top
C8  47.75,10.5 270 top
C9  20.88,70.5 90 top
C10  14.12,41.38 90 top
C11  17.12,77.25 180 top
C12  37.38,9 180 top
C13  40.25,15.12 0 top
C14  21.75,70.5 90 top
C15  47.62,37.12 180 top
C16  47.62,39.12 0 top
C17  46.12,43 270 top
C18  39.38,16.25 0 top
C19  44,77.38 180 top
C20  50.38,10.5 270 top
C21  13.12,38.25 270 top
C22  17.12,78.12 180 top
C23  37.38,13.62 0 top
C24  38.25,12.75 180 top
C25  49.5,10.5 270 top
C26  44,78.25 180 top
C27  20,70.5 90 top
C28  18.69,71.38 0 top
C29  10,38 270 top
C30  9,43 270 top
C31  19.62,77.88 0 top
C32  12,38 270 top
C33  52,77 90 top
C34  53,73 90 top
C35  48,77 90 top
C36  32,72 90 top
C37  33,69 0 top
C38  28,72 90 top
C39  57,10 270 top
C40  53,6 180 top
C41  53,10 270 top
C42  50,16 180 top
C43  53,17 180 top
C44  49,14 90 top
C45  55,40 90 top
C46  55,32 270 top
C47  51,37 270 top
C48  31,42 90 top
C49  32,47 90 top
C50  37,42 90 top
ESD2  39.25,6.12 0 top
JP1  56,49 180 top
JP2  22,44 270 top
JP3  9,46 180 top
JP4  49,70 0 top
JP5  31,66 0 top
JP6  56,5 0 top
JP7  59,15 180 top
JP8  34,14 180 top
JP9  57,35 0 top
JP10  30,46 180 top
JP11  55,25 180 top
JP12  47,66 180 top
JP13  34,58 180 top
JP14  25,67 90 top
JP15  20,75 0 top
JP16  13,75 180 top
JTAG1  64.12,46 270 top
L2  46.12,11.62 0 top
L3  42.38,8.88 0 top
L4  41.88,7.5 90 top
L5  41,6.62 90 top
L6  43.38,11.5 180 top
L7  42.38,9.75 0 top
L8  22.06,68 90 top
L9  17,73.38 0 top
LED1  39.75,36.62 270 top
R1  47,49.75 0 top
R2  16.38,70.5 270 top
R3  17.25,70.5 270 top
R4  18.5,63.75 270 top
R5  38.38,15.38 0 top
R6  38.75,14.06 270 top
R7  43.38,46.19 0 top
U1  43.62,39.12 270 top
U2  43.88,14.5 90 top
U3  18.25,67.12 180 top
U4  16,39.12 0 top
U5  40.25,13.5 90 top
U6  16.62,75.75 180 top
U7  47.25,45.38 270 top
U8  47.75,48.25 0 top
U9  43.12,75.12 270 top
U10  11,42 270 top
U11  38.38,10.88 0 top
U12  50,74 90 top
U13  30,70 90 top
U14  55,9 90 top
U15  52,14 180 top
U16  54,36 90 top
U17  34,43 270 top
Y1  18.69,70.25 0 top

### Tracks (layer width: path | path; a pad name or v marks a point on that pad's centre or on a via)
1.8V  (via drill 0.5, 0.6)
  Top 0.2: U7.5 48.5,46.38 | 48.55,46.17 U7.5 | 48.38,48.88 48.5,48.91 U8.5 48.42,48.91 47.88,48.37 47.88,46.25 | 47.88,46.25 48.3,46.33 U7.5 | 47.88,46.25 47.88,45.5 47.25,44.88 47.25,44.38 | C17.1 46.13,43.5 47,43.5 v47.25,43.25 47.25,44.38 | U7.3 46,44.38 47.25,44.38
  Top 0.8: JP4.2 53.28,68.44 53.28,55 | 53.28,55 JP1.2 | JP6.2 58.72,14.54 JP7.1 59.18,34.46 JP9.2 65,35 69,39 69,51 65,55 53.28,55 | JP10.2 27,46 25,48 8.28,48 JP3.2 6.28,39 21.14,24.14 | JP8.2 21.14,24.14 | LED1.A 33.62,36.62 21.14,24.14 | v34,54 35,54 38,57 38,61.72 JP5.2
  Bottom 0.4: 47.25,42.12 v47.25,43.25 49.38,45.38 49.38,46 52.38,49 JP1.2
  Bottom 0.8: JP5.2 35.72,68 50,68 51.72,69.72 JP4.2 | v34,54 27.28,47.28 JP10.2
!RESET
  Top 0.152: U1.26 48.88,37.88 49.5,38.5 49.5,47.38 49.28,47.59 U8.4
ANT  (via drill 0.33)
  Top 0.4: ESD2.2 L5.1
  Top 0.406: 41,5 L5.1 C1.1
  other vias: 40.12,5 41.88,5 41.88,1.5 40.12,1.5
  pour Top: 39.62,0 42.38,0 42.38,5.38 39.62,5.38
EXT!RESET  (via drill 0.33)
  Top 0.152: U8.1 46.62,49 | R1.2 49.25,49.75 49.69,49.31 49.69,47.81 50.25,47.25 59.75,47.25 60.25,46.75 60.25,45.88 60.75,45.38 63.75,45.38 64.25,44.88 64.25,44.25 64.88,43.62 65.5,43.62 | 65.5,43.62 65.81,43.62 JTAG1.10 66.58,43.46 v66.62,43.5 | v65.38,43.5 65.5,43.62
  Top 0.2: U8.1 46.74,48.88 47.12,48.88 47.51,49.26 R1.2
EXT_THERMISTOR_SENSE  (via drill 0.5)
  Top 0.2: U1.4 43.88,44.75 v43.75,44.88
  Top 0.4: R7.2 43.88,45.01 v43.75,44.88
FILTER1
  Top 0.406: C6.1 41.87,10.62 L7.1 L3.1 | L3.1 41.88,9 L4.2 | C3.1 L3.1
FILTER2
  Top 0.406: C2.1 41.02,7.13 | 41.02,7.13 41.88,7.13 L4.1 | 41.02,7.13 L5.2
GIMO
  Top 0.152: U1.7 42.38,42 42.06,42.31 41.19,42.31 | U3.34 19.65,64.85
  Top 0.2: 41.19,42.31 40.19,42.31 26.38,56.13 JP13.4 19.65,64.85
GND  (via drill 0.33)
  Top 0.152: U1.10 v42.38,40.38 U1.33 43.62,40.38 v44.88,40.38 | 42.88,14.25 42.62,14.5 U2.18 40.88,14.5 | U1.28 45,38.88 45,38 v44.88,37.88 | 41.12,14.25 40.87,14.25 U5.2 | U2.PAD v44.88,15.5 | 16.32,68.92 U3.18 16.32,68.89 16.56,68.66 16.94,68.66 17.25,68.34 v17.25,68.12 17.05,67.92 U3.20 | v19.25,66.12 19.62,65.75 | 19.62,65.75 19.62,65.84 19.59,65.81 | 20.14,65.33 U3.1 20.11,65.42 19.94,65.59 19.56,65.59 19.41,65.75 19.62,65.75 | U3.5 19.59,67.12 | U3.28 v17.25,66.12 17.03,66.12 16.84,66.31 16.34,66.31 | 17.66,64.72 U3.29 | U3.29 | U3.29 17.66,65.66 | 15.81,66.72 16.81,66.72 16.94,66.59 16.94,66.34 | 16.34,66.31 15.75,66.31 15.75,65.94 15.78,65.91 16.81,65.91 | U3.24 16.34,66.31 | 50.25,48.5 50,48.75 50,49.5 49.38,50.12 48.5,50.12 | 48.5,50.12 48.12,50.12 | R1.1 46.49,50.43 46.5,50.44 48.19,50.44 48.5,50.12 | 61.31,47.25 v62,47.25 | 62.26,47.25 JTAG1.3 62.3,47.25 v63,47.25
  Top 0.2: v47.12,46.75 46.88,46.5 | 17,72 18.62,72 | U4.4 16.75,37.5 16.56,37.31 15.19,37.31
  Top 0.305: 42.88,14.25 v42.88,13.5 | U2.5 v44.88,13.5
  Top 0.32: C24.2 38.12,12.37 38.12,12
  Top 0.4: v63,47.25 v63,46 JTAG1.5 v62,46 | 62.26,47.25 v62,47.25
  other vias: 42.38,37.88 46,12.5 38.75,5 38.75,1.5 43.25,5 43.25,1.5 42.69,10.69 37.5,8 41,8 39,8 48.5,7.88 46.5,9.75 43.88,9.62 39,8.88 40,8 42.75,7.88 46.5,7.88 44.62,7.88 48.62,9.5 40.75,13.5 47.12,36.12 48.38,40.25 42.88,15.5 17.88,37.12 37.5,6.5 21.5,71.88 40.12,75.12 42.5,77.62 40.12,73.5 20.12,71.88 46.12,41.62 41.88,75.12 19.25,68.12 15.38,65.38 15.38,63.38 17.56,64.25 15.75,77.25 15.75,78.12 40.94,11.75 40.94,9.88 37.88,14.5 37.88,16.25 40.94,10.81 38.38,11.75 37.5,5 43.88,6.12 37.5,1.5 37.5,3.25 38.75,3.25 43.25,3.25 16.62,75.25 41,77.62 40.12,76.75 45,6.5 48.5,6.5 45,1.5 42.88,45.38 34,43 36,44 38,42 33,47 29,51 27,53 25,55 22,58 20,60 33,55 31,61 27,64 30,70 28,74 32,74 35,70 25,73 22,78 7,78 11,78 7,74 14,72 14,68 14,61 14,57 14,53 10,53 6,53 2,53 26,50 22,50 18,50 14,50 10,50 6,50 2,49 33,64 36,61 37,66 39,64 40,61 40,58 39,55 37,53 39,51 41,49 43,47 43,51 43,55 43,59 43,63 43,70 39,70 26,78 30,78 34,78 38,78 38,74 49,78 53,78 53,75 57,78 61,78 65,78 69,78 56,74 56,70 56,66 56,57 60,57 64,57 67,56 69,54 71,52 73,78 73,74 78,74 78,70 78,66 78,62 78,58 78,54 78,50 78,46 78,42 78,38 78,34 78,30 78,26 78,22 78,18 78,14 78,10 78,6 74,6 74,2 70,2 66,2 62,2 58,2 54,2 2,6 6,6 6,2 10,2 14,2 18,2 22,2 26,2 30,2 34,2 50,2 2,45 2,41 2,37 2,33 2,29 2,25 2,21 2,17 2,13 2,9 5,37 8,34 11,31 11,42 8,41 9,39 12,36 14,46 18,46 22,46 14,43 18,43 25,44 27,42 30,41 31,44 31,49 14,28 17,25 20,22 23,19 26,16 29,13 14,34 17,31 20,28 22,28 24,30 26,32 28,34 30,36 28,37 26,37 33,33 31,31 29,29 27,27 25,25 35,35 38,35 36,33 34,31 32,29 30,27 25,23 28,20 31,17 31,20 34,16 35,11 35,7 51,66 51,62 51,58 51,54 51,50 48,52 48,56 48,60 48,64 55,53 59,53 63,53 63,51 55,51 59,51 66,51 71,48 71,44 71,40 69,37 67,35 61,33 61,29 61,25 61,21 61,17 61,13 61,9 61,5 64,33 55,9 51,7 45,4 51,5 51,9 52,14 48,16 50,18 52,20 54,22 51,17 54,20 55,12 57,8 48,12 50,12 52,12 57,12 57,18 57,21 57,24 57,27 57,30 57,33 54,31 51,31 48,31 47,32 47,34 49,36 52,36 52,34 51,42 51,39 53,39 53,42 55,42 57,42 59,42 57,39 51,46 53,46 55,46 57,46 59,46 57,37 64,37 66,39 67,42 61,37 63,42
  pour Top (isolate 0.2): 0,80 80,80 80,0 42.88,0 42.88,5.88 39.12,5.88 39.12,0 0,0
  pour Bottom (isolate 0.2): 0,80 80,80 80,0 0,0
GOMI
  Top 0.152: U3.33 19.25,64.75 | 41.12,41.88 41.88,41.88 U1.8
  Top 0.2: 41.12,41.88 40.12,41.88 24.13,57.87 JP13.5 23.84,60.16 19.25,64.75
GPS_ANT
  Top 0.152: 16.88,64.75 16.62,64.5 16.62,64.38
  Top 0.2: U3.27 16.85,64.35 16.62,64.38
  Top 0.6: A1.1 16.62,64.38
GPS_VDD  (via drill 0.33)
  Top 0.2: U3.8 U3.9
  Top 0.32: U3.9 20.81,69.59 20.81,69.81 C9.1
  Top 0.4: C9.1 C14.1 22.99,69.99 24.49,71.49 27,71.49 | U13.5 28.86,71.49 C38.1 27,71.49 | R4.2 19,62.74 v19,62 | v23,66 24,65 26,65 27,66 27,71.49
  Bottom 0.4: v23,66 v19,62
LED1
  Top 0.152: U1.16 41.12,37.25 LED1.C
MEM_CSN
  Top 0.152: 17.38,38.88 17.19,38.69 15.69,38.69 15.25,38.25 U4.1
  Top 0.2: U1.13 41.08,38.92 JP2.3 17.42,38.92 17.38,38.88
MEM_MISO
  Top 0.152: U4.2 15.75,38.25 15.88,38.38 17.62,38.38 18,38
  Top 0.2: 18,38 19.62,36.38 JP2.4 23.38,36.38 25.38,38.38 U1.14
MEM_MOSI
  Top 0.152: 17.25,39.88 U4.5
  Top 0.2: U1.11 27.12,39.88 23,44 JP2.1 21.38,44 17.25,39.88
MEM_SCK
  Top 0.152: 17.25,39.38 16.88,39.75 16.62,39.75 16.25,40.12 U4.6
  Top 0.2: U1.12 24.62,39.38 22.54,41.46 JP2.2 19.79,39.38 17.25,39.38
N$1  (via drill 0.33)
  other vias: 63,44.75
N$2  (via drill 0.33)
  other vias: 62,44.75
N$3  (via drill 0.33)
  other vias: 62,43.5
N$4  (via drill 0.33)
  other vias: 63,43.5
N$5
  Top 0.4: JP1.1 56.64,48.54 JTAG1.1
N$6  (via drill 0.33)
  other vias: 66.62,44.75
N$7  (via drill 0.33)
  other vias: 66.62,46
N$8
  Top 0.4: C30.1 9.85,43.51 U10.3 9.18,44.18 JP3.1 11,46 12,45 12,43.36 U10.1
N$9
  Top 0.4: U10.4 10,40.64 C29.1
N$10  (via drill 0.33)
  other vias: 65.38,44.75
N$11  (via drill 0.33)
  other vias: 65.38,46
N$12
  Top 0.2: U4.7 U4.8
  Top 0.4: U4.8 14.62,40.38 C10.1 13.96,40.7 | U10.5 13.96,40.7 | C32.1 12.88,38.51 C21.1 13.12,39.87 13.96,40.7
N$13
  Top 0.4: U12.1 49.06,70.24 JP4.1 50.94,72.12 U12.3 51.15,72.49 C34.1
N$14
  Top 0.4: C33.1 50.94,75.43 U12.4
N$15
  Top 0.4: U9.2 U9.1 | C26.1 C19.1 44.51,76.72 U9.1 | U9.1 47.73,76.22 | 47.73,76.22 C35.1 | U12.5 48.13,76.22 47.73,76.22
N$16
  Top 0.4: C37.1 31.23,69 U13.3 30.94,66.12 JP5.1 29.06,67.76 U13.1
N$17
  Top 0.4: C36.1 31.14,71.49 U13.4
N$18
  Top 0.4: U16.1 53.06,33.94 54,33 54.51,33 C46.1 54.94,32.57 U16.3 55.23,35 JP9.1
N$19
  Top 0.4: C40.1 54.06,6.55 U14.1 54.06,6.76 JP6.1 55.94,5.12 U14.3
N$20
  Top 0.4: U14.4 56.15,10.51 C39.1
N$21
  Top 0.4: U16.4 54.94,39.43 C45.1
N$22
  Top 0.4: C43.1 53.51,15.15 U15.3 56.22,14.94 JP7.2 54.34,13.06 U15.1
N$23
  Top 0.4: C42.1 50.51,15.14 U15.4
N$24
  Top 0.2: U2.8 47.5,14.5 48.51,13.49 | 48.51,13.49 C44.1 | U2.6 45.85,13.49 48.51,13.49
  Top 0.4: C44.1 49.43,13.06 U15.5
N$25  (via drill 0.33)
  Top 0.2: U1.30 47.12,39.88 v47.25,40
  Top 0.4: v50,38 50.49,37.51 C47.1 | C47.1 49.51,37.51 49,37 48.26,37 C15.1 | C47.1 52.85,37.51 U16.5
  Bottom 0.4: v47.25,40 49.25,38 v50,38
N$26
  Top 0.4: U17.1 34.94,45.06 34,46 33,46 | 33,46 32,46 | 32,46 JP10.1 | C49.1 32,46 | U17.3 33.06,45.94 33,46
N$27
  Top 0.4: C48.1 32.85,41.49 U17.4
N$30
  Top 0.4: U1.9 41,41 37.49,41 C50.1 35.15,41.49 U17.5
RADIO_VDD
  Top 0.152: 50.5,11.01 50.49,11.12 50.38,11.12 50.38,11.13 C7.1 51.5,11.13
  Top 0.4: 51.5,11.13 52.38,11.13 C41.1 53.85,10.51 U14.5 | L2.2 47.13,11.62 C8.1
  Top 0.406: C7.1 50.5,11.01 C20.1 C25.1 C8.1
RADIO_XIN
  Top 0.152: U2.17 40.88,15 C13.2
RF_OUT
  Top 0.254: U2.4 44.38,12.12 44.88,11.62 L2.1 45.68,11.75
  Top 0.406: L2.1 45.62,11.69 C4.2
RF_TANK
  Top 0.4: L3.2 43,8.76 43,8.75 45.13,8.75 arc90 C4.1
RF_TCXO_REG_EN  (via drill 0.33)
  Top 0.2: U1.17 41.88,36.25 34.68,29.05 JP11.9 37.62,21.93 37.62,18.62 v37,18
  Top 0.4: U11.3 37.14,10 v38.25,10
  Bottom 0.2: v38.25,10 37.5,10 37.12,10.38 37.12,17.88 v37,18
RTC_XI
  Top 0.2: Y1.1 18.85,69.86 U3.12
  Top 0.4: C27.1 19.5,69.99 Y1.1
RTC_XO
  Top 0.2: U3.13 18.45,69.94 Y1.2
  Top 0.4: Y1.2 18.14,71.21 C28.1
RXN
  Top 0.254: U2.3 L6.1
  Top 0.406: L7.2 43.88,10.76 | 43.88,10.76 L6.1 | 43.88,10.76 44.13,11.01 C5.1
RXP
  Top 0.254: U2.2 43.38,12.13 42.88,11.63 | 42.88,11.63 L6.2 | 42.88,11.63 L6.2
  Top 0.406: C6.2 42.86,11.63 L6.2
SAM_XOSC
  Top 0.152: 39.75,36.13 39.75,37 40.62,37.88 U1.15
  Top 0.2: 39.75,36.13 39.75,34.75 32,27 32,25.27 JP11.10 32.14,19.86 35,17 38.12,17 C18.1
  Top 0.4: 38.87,15.39 R5.2 38.75,15.51 | R6.1 38.75,15.51 | C18.1 38.75,16.13 38.75,15.51
SCL
  Top 0.152: U1.2 44.88,42.75 44.75,42.88 44.75,48.12 45.38,48.75 | 45.38,73.4 45,73.78 U9.8
  Top 0.2: 45.38,48.75 44.46,49.66 JP12.2 45.38,67.04 45.38,73.4
SDA
  Top 0.152: U1.1 45.38,42.88 45.06,43.19 45.06,47.94 45.75,48.62 | 45.75,74.62 45.38,75 44.38,75 43.75,74.38 U9.7
  Top 0.2: 45.75,48.62 45.75,64.62 JP12.1 47,73.38 45.75,74.62
SE_GPIO0
  Top 0.152: U3.17 16.85,69.4 16.38,69.88 R2.2
SE_GPIO1
  Top 0.152: U3.16 R3.2
SE_MODE_PULL
  Top 0.2: U3.31 18.45,64.31 R4.1
SE_ON_OFF
  Top 0.152: U3.3 20.49,66.33 20.75,66.06 20.75,65.12 | 41.88,43 42,43 42.88,42.12 U1.6
  Top 0.2: 20.75,65.12 25.88,60 27,60 28.92,58.08 JP13.3 | 29,57.87 JP13.3 | 41.88,43 28.92,55.95 JP13.3
SE_TCXO_CLK
  Top 0.152: U3.21 15.85,67.53 15.5,67.88 15.5,74.89 U6.3
  Top 0.4: JP16.1 15.62,75 U6.3
SE_VBB
  Top 0.2: U3.6 21.75,67.53 L8.1
  Top 0.4: L8.1 24.55,67.28 JP14.1
SE_VCC_TCXO
  Top 0.152: U3.19 15.99,68.33 15.81,68.5 15.81,72.44 16.27,72.9 L9.1
SE_VREG
  Top 0.2: U3.7 20.55,67.92 21.35,68.72 L8.2
  Top 0.4: L8.2 24.01,68.72 JP14.2
SI_GPIO0
  Top 0.152: U2.9 46.19,15 46.42,15.24 46.42,15.83 | 46.17,37.33 U1.25 45.88,37.38
  Top 0.2: 45.88,37.38 46,37.25 46,32 48,30 54,30 55,29 JP11.1 55,24.4 46.42,15.83
SI_GPIO1
  Top 0.152: 45.62,15.5 U2.10 45.38,15.97
  Top 0.2: U1.24 45.38,31.62 48,29 48.59,29 JP11.2 45.38,18.04 45.38,15.97
SI_MISO
  Top 0.2: U1.21 43.88,29.12 45,28 45,25.03 JP11.5 43.88,23.91 U2.13
SI_MOSI
  Top 0.2: U1.20 43.38,26.2 JP11.6 43.38,24.05 U2.14
SI_NIRQ
  Top 0.2: U1.23 44.88,31.12 50,26 50,24.95 JP11.3 44.88,19.83 U2.11
SI_NSEL
  Top 0.2: U1.19 42.88,27.99 JP11.7 42.88,21.76 U2.15
SI_SCLK
  Top 0.2: U1.22 44.38,30.62 47,28 47,25.51 JP11.4 44.38,22.12 U2.12
SI_SDN  (via drill 0.33)
  Top 0.152: 42.88,12.72 U2.1 42.88,12.75 v41.88,12.75
  Top 0.2: U1.18 42.38,30.28 JP11.8 40.75,21.6 v40.75,16
  Bottom 0.152: v40.75,16 40.12,15.38 40.12,12.75 40.5,12.38 41.5,12.38 v41.88,12.75
SWDCLK  (via drill 0.33)
  Top 0.152: U1.31 46.5,40.38 v48.38,42.25 | JTAG1.4 65.25,47.27 64.98,47.27
  Top 0.2: v65.38,47.25 65.36,47.27 65.25,47.27 | v66.62,47.25 66.61,47.27 JTAG1.4
  Bottom 0.152: v48.38,42.25 48.5,42.25 49.75,43.5 59.5,43.5 60.12,44.12 63.88,44.12 64.38,44.62 64.38,46.62 65,47.25 v65.38,47.25
SWDIO  (via drill 0.33)
  Top 0.152: 65.88,48.69 JTAG1.2 | U1.32 46.38,40.88 47.62,42.12 47.62,42.5 v48.38,43.25
  Top 0.2: v66.62,48.5 66.58,48.54 JTAG1.2 | 65.88,48.69 65.88,48.62 65.75,48.5 v65.38,48.5
  Bottom 0.152: v48.38,43.25 48.5,43.25 50,44.75 60.12,44.75 60.75,45.38 63.62,45.38 63.88,45.62 63.88,47.38 65,48.5 v65.38,48.5
TCXO_OUT
  Top 0.4: 39.69,14.75 U5.3 | C13.1 39.74,16.11 C18.2
  Top 0.406: C13.1 39.74,14.38 U5.3
TCXO_REG_IN
  Top 0.4: U11.1 36.87,12.03 C23.1 34.55,13.62 JP8.1
TCXO_REG_NR
  Top 0.2: C12.1 38.25,9 39.19,9.94 U11.4
TCXO_VDD
  Top 0.32: R6.2 C24.1 39.61,12.75 39.62,12.74
  Top 0.4: 39.62,12.74 U5.4 39.67,12.66 U11.5
TCXO_VDD1
  Top 0.4: L9.2 17.45,73.65 U6.4 17.52,75.25 18,75.25 18.25,75.5 | C22.1 C11.1 18.25,77.25 | 18.25,75.5 18.25,77.25 | 18.25,77.25 18.75,77.75 C31.1 | 18.25,75.5 19.32,75.5 JP15.1
TIMEPULSE
  Top 0.152: U3.4 20.52,66.72 21.12,66.12 | 43.38,42 U1.5 43.38,43 43.12,43.25
  Top 0.2: 21.12,66.12 25.25,62 28,62 31.46,58.54 JP13.2 31.46,54.91 43.12,43.25
VDD_CORE
  Top 0.2: U1.29 46.88,39.38 47.12,39.13 C16.1
WDI
  Top 0.152: U1.27 48.75,38.38 49.12,38.75 49.12,44.12 48.83,44.42 U7.4
WDI!RESET
  Top 0.152: U8.2 45.88,48.25 45.5,47.88 45.5,46.5 45.67,46.33 U7.1

### Text on the board
tPlace: MS5607 | GND | X | VCC_X | GND | VR_O | GPS | MS5607 | VBB_I | GND | SCL | SDA | BRISTOL | UNIVERSITY | V0.986.9 | GOMI | GIMO | ON_ | TIME | GND | ALL | MEMORY | MCU ANALOG | ARM SWD | MOSI | SCK | !CS | MISO | MCU DIGITAL | GND | GND | SAM_X | T_EN | SDN | !SEL | MOSI | MISO | SCLK | !IRQ | GPIO1 | GPIO0 | RADIO IC | TCXO | Richard Meadows 2015 | 144MHz / 434MHz | RF Out | RADIO PA